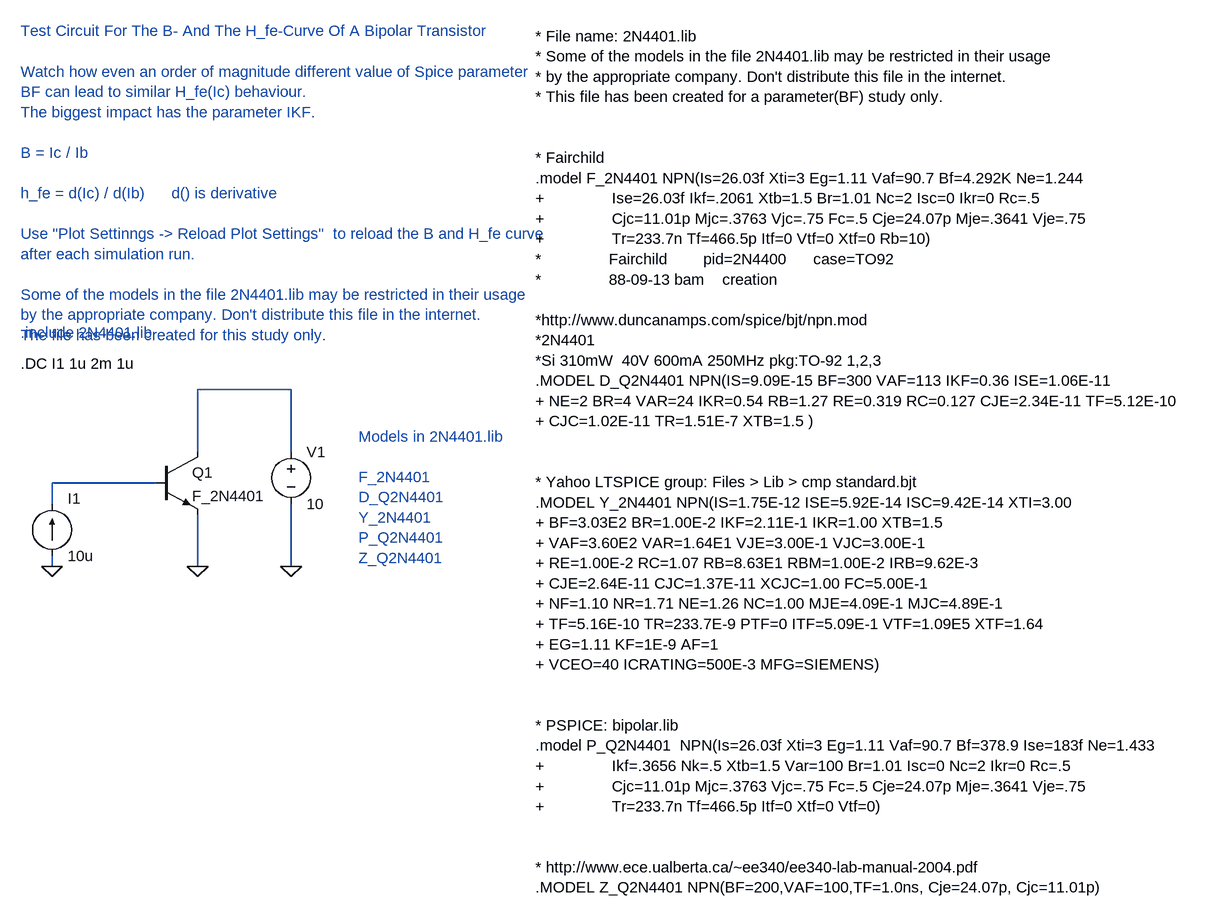
[diagram p0: schematic 2N4401_hfe_B.asc]
2N4401_hfe_B.asc, the LTspice schematic file:
Version 4
SHEET 1 1944 920
WIRE 0 320 0 288
WIRE 0 416 0 400
WIRE 160 288 0 288
WIRE 224 240 224 144
WIRE 224 416 224 336
WIRE 368 144 224 144
WIRE 368 240 368 144
WIRE 368 416 368 320
FLAG 224 416 0
FLAG 368 416 0
FLAG 0 416 0
SYMBOL npn 160 240 R0
SYMATTR InstName Q1
SYMATTR Value F_2N4401
SYMBOL voltage 368 224 R0
SYMATTR InstName V1
SYMATTR Value 10
SYMBOL current 0 400 M180
WINDOW 0 24 88 Left 0
WINDOW 3 24 0 Left 0
SYMATTR InstName I1
SYMATTR Value 10u
TEXT -48 104 Left 0 !.DC I1 1u 2m 1u
TEXT -48 -408 Left 0 ;Test Circuit For The B- And The H_fe-Curve Of A Bipolar Transistor\n \nWatch how even an order of magnitude different value of Spice parameter \nBF can lead to similar H_fe(Ic) behaviour. \nThe biggest impact has the parameter IKF. \n \nB = Ic / Ib\n \nh_fe = d(Ic) / d(Ib)      d() is derivative\n \nUse "Plot Settinngs -> Reload Plot Settings"  to reload the B and H_fe curve\nafter each simulation run.\n \nSome of the models in the file 2N4401.lib may be restricted in their usage\nby the appropriate company. Don't distribute this file in the internet.\nThe file has been created for this study only.
TEXT -48 56 Left 0 ;.include 2N4401.lib
TEXT 472 216 Left 0 ;Models in 2N4401.lib\n \nF_2N4401\nD_Q2N4401\nY_2N4401\nP_Q2N4401\nZ_Q2N4401
TEXT 744 -400 Left 0 !* File name: 2N4401.lib\n* Some of the models in the file 2N4401.lib may be restricted in their usage\n* by the appropriate company. Don't distribute this file in the internet.\n* This file has been created for a parameter(BF) study only.\n \n\n* Fairchild\n.model F_2N4401 NPN(Is=26.03f Xti=3 Eg=1.11 Vaf=90.7 Bf=4.292K Ne=1.244\n+               Ise=26.03f Ikf=.2061 Xtb=1.5 Br=1.01 Nc=2 Isc=0 Ikr=0 Rc=.5\n+               Cjc=11.01p Mjc=.3763 Vjc=.75 Fc=.5 Cje=24.07p Mje=.3641 Vje=.75\n+               Tr=233.7n Tf=466.5p Itf=0 Vtf=0 Xtf=0 Rb=10)\n*               Fairchild        pid=2N4400      case=TO92\n*               88-09-13 bam    creation\n \n*http://www.duncanamps.com/spice/bjt/npn.mod\n*2N4401\n*Si 310mW  40V 600mA 250MHz pkg:TO-92 1,2,3\n.MODEL D_Q2N4401 NPN(IS=9.09E-15 BF=300 VAF=113 IKF=0.36 ISE=1.06E-11 \n+ NE=2 BR=4 VAR=24 IKR=0.54 RB=1.27 RE=0.319 RC=0.127 CJE=2.34E-11 TF=5.12E-10 \n+ CJC=1.02E-11 TR=1.51E-7 XTB=1.5 )\n \n\n* Yahoo LTSPICE group: Files > Lib > cmp standard.bjt\n.MODEL Y_2N4401 NPN(IS=1.75E-12 ISE=5.92E-14 ISC=9.42E-14 XTI=3.00\n+ BF=3.03E2 BR=1.00E-2 IKF=2.11E-1 IKR=1.00 XTB=1.5\n+ VAF=3.60E2 VAR=1.64E1 VJE=3.00E-1 VJC=3.00E-1\n+ RE=1.00E-2 RC=1.07 RB=8.63E1 RBM=1.00E-2 IRB=9.62E-3\n+ CJE=2.64E-11 CJC=1.37E-11 XCJC=1.00 FC=5.00E-1\n+ NF=1.10 NR=1.71 NE=1.26 NC=1.00 MJE=4.09E-1 MJC=4.89E-1\n+ TF=5.16E-10 TR=233.7E-9 PTF=0 ITF=5.09E-1 VTF=1.09E5 XTF=1.64\n+ EG=1.11 KF=1E-9 AF=1\n+ VCEO=40 ICRATING=500E-3 MFG=SIEMENS)\n \n\n* PSPICE: bipolar.lib\n.model P_Q2N4401  NPN(Is=26.03f Xti=3 Eg=1.11 Vaf=90.7 Bf=378.9 Ise=183f Ne=1.433\n+               Ikf=.3656 Nk=.5 Xtb=1.5 Var=100 Br=1.01 Isc=0 Nc=2 Ikr=0 Rc=.5\n+               Cjc=11.01p Mjc=.3763 Vjc=.75 Fc=.5 Cje=24.07p Mje=.3641 Vje=.75\n+               Tr=233.7n Tf=466.5p Itf=0 Xtf=0 Vtf=0)\n \n\n* http://www.ece.ualberta.ca/~ee340/ee340-lab-manual-2004.pdf\n.MODEL Z_Q2N4401 NPN(BF=200,VAF=100,TF=1.0ns, Cje=24.07p, Cjc=11.01p)

The netlist it stands for:
* 2N4401_hfe_B.asc
Q1 N002 N001 0 0 F_2N4401
V1 N002 0 10
I1 0 N001 10u
.model NPN NPN
.model PNP PNP
.lib standard.bjt
.DC I1 1u 2m 1u
* Test Circuit For The B- And The H_fe-Curve Of A Bipolar Transistor
* Watch how even an order of magnitude different value of Spice parameter
* BF can lead to similar H_fe(Ic) behaviour.
* The biggest impact has the parameter IKF.
* B = Ic / Ib
* h_fe = d(Ic) / d(Ib)      d() is derivative
* Use "Plot Settinngs -> Reload Plot Settings"  to reload the B and H_fe curve
* after each simulation run.
* Some of the models in the file 2N4401.lib may be restricted in their usage
* by the appropriate company. Don't distribute this file in the internet.
* The file has been created for this study only.
* .include 2N4401.lib
* Models in 2N4401.lib
* F_2N4401
* D_Q2N4401
* Y_2N4401
* P_Q2N4401
* Z_Q2N4401
* File name: 2N4401.lib
* Some of the models in the file 2N4401.lib may be restricted in their usage
* by the appropriate company. Don't distribute this file in the internet.
* This file has been created for a parameter(BF) study only.
* Fairchild
.model F_2N4401 NPN(Is=26.03f Xti=3 Eg=1.11 Vaf=90.7 Bf=4.292K Ne=1.244
+               Ise=26.03f Ikf=.2061 Xtb=1.5 Br=1.01 Nc=2 Isc=0 Ikr=0 Rc=.5
+               Cjc=11.01p Mjc=.3763 Vjc=.75 Fc=.5 Cje=24.07p Mje=.3641 Vje=.75
+               Tr=233.7n Tf=466.5p Itf=0 Vtf=0 Xtf=0 Rb=10)
*               Fairchild        pid=2N4400      case=TO92
*               88-09-13 bam    creation
*http://www.duncanamps.com/spice/bjt/npn.mod
*2N4401
*Si 310mW  40V 600mA 250MHz pkg:TO-92 1,2,3
.MODEL D_Q2N4401 NPN(IS=9.09E-15 BF=300 VAF=113 IKF=0.36 ISE=1.06E-11
+ NE=2 BR=4 VAR=24 IKR=0.54 RB=1.27 RE=0.319 RC=0.127 CJE=2.34E-11 TF=5.12E-10
+ CJC=1.02E-11 TR=1.51E-7 XTB=1.5 )
* Yahoo LTSPICE group: Files > Lib > cmp standard.bjt
.MODEL Y_2N4401 NPN(IS=1.75E-12 ISE=5.92E-14 ISC=9.42E-14 XTI=3.00
+ BF=3.03E2 BR=1.00E-2 IKF=2.11E-1 IKR=1.00 XTB=1.5
+ VAF=3.60E2 VAR=1.64E1 VJE=3.00E-1 VJC=3.00E-1
+ RE=1.00E-2 RC=1.07 RB=8.63E1 RBM=1.00E-2 IRB=9.62E-3
+ CJE=2.64E-11 CJC=1.37E-11 XCJC=1.00 FC=5.00E-1
+ NF=1.10 NR=1.71 NE=1.26 NC=1.00 MJE=4.09E-1 MJC=4.89E-1
+ TF=5.16E-10 TR=233.7E-9 PTF=0 ITF=5.09E-1 VTF=1.09E5 XTF=1.64
+ EG=1.11 KF=1E-9 AF=1
+ VCEO=40 ICRATING=500E-3 MFG=SIEMENS)
* PSPICE: bipolar.lib
.model P_Q2N4401  NPN(Is=26.03f Xti=3 Eg=1.11 Vaf=90.7 Bf=378.9 Ise=183f Ne=1.433
+               Ikf=.3656 Nk=.5 Xtb=1.5 Var=100 Br=1.01 Isc=0 Nc=2 Ikr=0 Rc=.5
+               Cjc=11.01p Mjc=.3763 Vjc=.75 Fc=.5 Cje=24.07p Mje=.3641 Vje=.75
+               Tr=233.7n Tf=466.5p Itf=0 Xtf=0 Vtf=0)
* http://www.ece.ualberta.ca/~ee340/ee340-lab-manual-2004.pdf
.MODEL Z_Q2N4401 NPN(BF=200,VAF=100,TF=1.0ns, Cje=24.07p, Cjc=11.01p)
.backanno
.end